# EAGLE schematic Schemat (EAGLE 7.6.0)
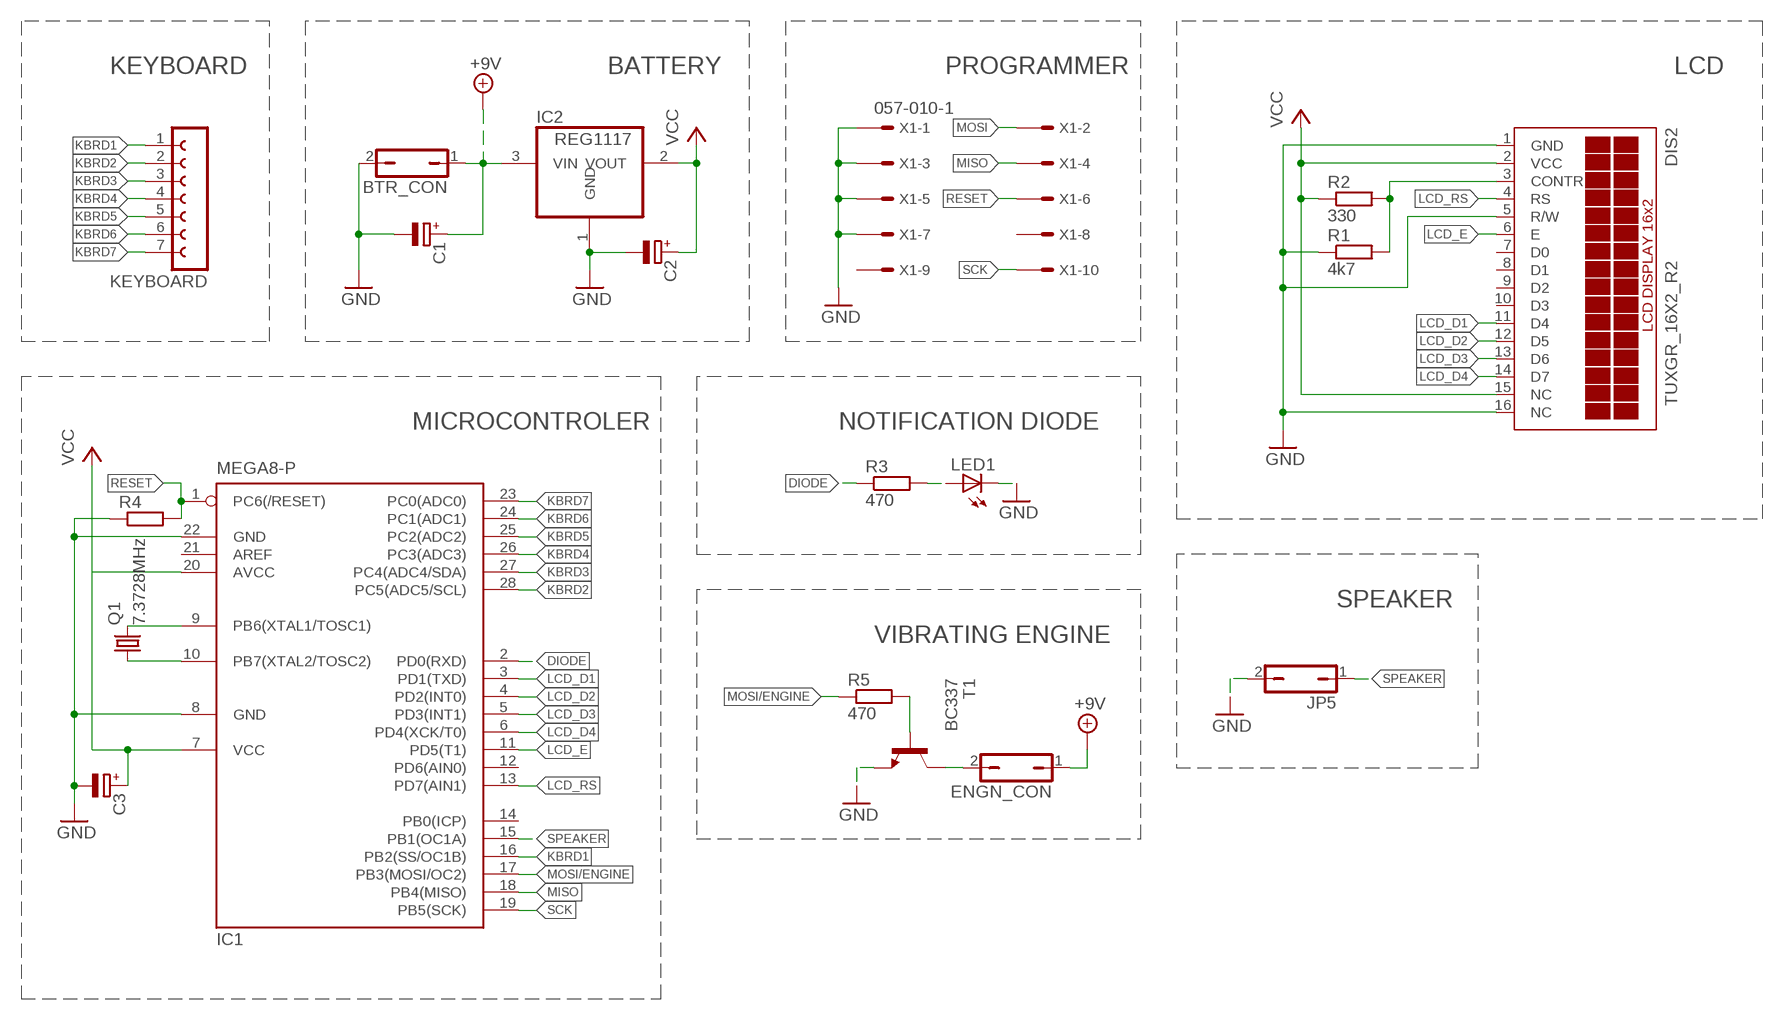
[diagram p0: schematic, sheet 1]

## Parts
BTR_CON  JP1Q  [JP1]
C1  CPOL-EU139CLL-2R  [139CLL-2R]
C2  CPOL-EU139CLL-2R  [139CLL-2R]
C3  CPOL-EU139CLL-2R  [139CLL-2R]
DIS2  TUXGR_16X2_R2  [TUXGR_16X2_R2]
ENGN_CON  JP1Q  [JP1]
IC1  MEGA8-P  [DIL28-3]
IC2  REG1117  [SOT223]
JP5  JP1Q  [JP1]
KEYBOARD  FE07-1  [FE07]
LED1  LED3MM  [LED3MM]
Q1  7.3728MHz  CRYSTALHC49S  [HC49/S]
R1  4k7  R-EU_0207/7  [0207/7]
R2  330  R-EU_0207/7  [0207/7]
R3  470  R-EU_0207/7  [0207/7]
R4  R-EU_0207/7  [0207/7]
R5  470  R-EU_0207/7  [0207/7]
T1  BC337  [TO92]
X1  057-010-1  [057-010-1]

## Nets
+9V: BTR_CON.1 C1.+ ENGN_CON.1 IC2.3(VIN)
DIODE: IC1.2(PD0(RXD)) R3.1
GND: BTR_CON.2 C1.- C2.- C3.- DIS2.1(GND) DIS2.5(R/W) DIS2.16(NC) IC1.8(GND) IC1.22(GND) IC2.1(GND) JP5.2 LED1.K(C) R1.1 R4.1 T1.1(E) X1.1 X1.3 X1.5 X1.7
KBRD1: IC1.16(PB2(SS/OC1B)) KEYBOARD.1
KBRD2: IC1.28(PC5(ADC5/SCL)) KEYBOARD.2
KBRD3: IC1.27(PC4(ADC4/SDA)) KEYBOARD.3
KBRD4: IC1.26(PC3(ADC3)) KEYBOARD.4
KBRD5: IC1.25(PC2(ADC2)) KEYBOARD.5
KBRD6: IC1.24(PC1(ADC1)) KEYBOARD.6
KBRD7: IC1.23(PC0(ADC0)) KEYBOARD.7
LCD_D1: DIS2.11(D4) IC1.3(PD1(TXD))
LCD_D2: DIS2.12(D5) IC1.4(PD2(INT0))
LCD_D3: DIS2.13(D6) IC1.5(PD3(INT1))
LCD_D4: DIS2.14(D7) IC1.6(PD4(XCK/T0))
LCD_E: DIS2.6(E) IC1.11(PD5(T1))
LCD_RS: DIS2.4(RS) IC1.13(PD7(AIN1))
MISO: IC1.18(PB4(MISO)) X1.4
MOSI: X1.2
MOSI/ENGINE: IC1.17(PB3(MOSI/OC2)) R5.1
N$1: IC1.9(PB6(XTAL1/TOSC1)) Q1.2
N$2: IC1.10(PB7(XTAL2/TOSC2)) Q1.1
N$3: DIS2.3(CONTR) R1.2 R2.2
N$4: ENGN_CON.2 T1.3(C)
N$5: LED1.A R3.2
N$6: C3.+ IC1.7(VCC)
N$7: R5.2 T1.2(B)
RESET: IC1.1(PC6(/RESET)) R4.2 X1.6
SCK: IC1.19(PB5(SCK)) X1.10
SPEAKER: IC1.15(PB1(OC1A)) JP5.1
VCC: C2.+ DIS2.2(VCC) DIS2.15(NC) IC1.20(AVCC) IC2.2(VOUT) R2.1
Unconnected: DIS2.7(D0) DIS2.8(D1) DIS2.9(D2) DIS2.10(D3) IC1.12(PD6(AIN0)) IC1.14(PB0(ICP)) IC1.21(AREF) X1.8 X1.9

## Notes on the sheet
- KEYBOARD | BATTERY | PROGRAMMER | LCD
- MICROCONTROLER | NOTIFICATION DIODE
- SPEAKER
- VIBRATING ENGINE

## Library data of the parts
BTR_CON ENGN_CON JP5 = jumper:JP1Q: JUMPER
C1-C3 = rcl:CPOL-EU: POLARIZED CAPACITOR, European symbol
DIS2 = display-lcd:TUXGR_16X2_R2: Tuxgraphics LCD display 16x2 characters reflective, without background light Source: tuxgr_12x2_r2.pdf; OC_FARNELL: unknown; OC_NEWARK: unknown
IC1 = atmel:MEGA8-P: MICROCONTROLLER 8 Kbytes FLASH, 1 kbytes SRAM, 512 bytes EEPROM, USART, 4-channel 10 bit ADC, 2-channel 8 bit ADC Pin compatible with Atmega48, ATMega88, ATMega168 Source: avr.lbr; OC_FARNELL: unknown; OC_NEWARK: unknown
IC2 = burr-brown:REG1117: 800mA and 1A Low Dropout (LDO) Positive Regulator 1.8V, 2.5V, 2.85V, 3.3V, 5V, and Adj; MPN: REG1117; OC_FARNELL: 1097566; OC_NEWARK: 14P6981
KEYBOARD = con-lsta:FE07-1: FEMALE HEADER; OC_FARNELL: unknown; OC_NEWARK: unknown
LED1 = led:LED: LED OSRAM: - CHIPLED LG R971, LG N971, LY N971, LG Q971, LY Q971, LO R971, LY R971 LH N974, LH R974 LS Q976, LO Q976, LY Q976 LO Q996 - Hyper CHIPLED LW Q18S LB Q993, LB Q99A, LB R99A - SideLED LS A670, LO A670, LY A670, LG A670, LP A670 LB A673, LV A673, LT A673, LW A673 LH A674 LY A675 LS A676, LA A676, LO A676, LY A676, LW A676 LS A679, LY A679, LG A679 - Hyper Micro SIDELED® LS Y876, LA Y876, LO Y876, LY Y876 LT Y87S - SmartLED LW L88C, LW L88S LB L89C, LB L89S, LG L890 LS L89K, LO L89K, LY L89K LS L896, LA L896, LO L896, LY L896 - TOPLED LS T670, LO T670, LY T670, LG T670, LP T670 LSG T670, LSP T670, LSY T670, LOP T670, LYG T670 LG T671, LOG T671, LSG T671 LB T673, LV T673, LT T673, LW T673 LH T674 LS T676, LA T676, LO T676, LY T676, LB T676, LH T676, LSB T676, LW T676 LB T67C, LV T67C, LT T67C, LS T67K, LO T67K, LY T67K, LW E67C LS E67B, LA E67B, LO E67B, LY E67B, LB E67C, LV E67C, LT E67C LW T67C LS T679, LY T679, LG T679 LS T770, LO T770, LY T770, LG T770, LP T770 LB T773, LV T773, LT T773, LW T773 LH T774 LS E675, LA E675, LY E675, LS T675 LS T776, LA T776, LO T776, LY T776, LB T776 LHGB T686 LT T68C, LB T68C - Hyper Mini TOPLED® LB M676 - Mini TOPLED Santana® LG M470 LS M47K, LO M47K, LY M47K Source: http://www.osram.convergy.de LUXEON: - LUMILED® LXK2-PW12-R00, LXK2-PW12-S00, LXK2-PW14-U00, LXK2-PW14-V00 LXK2-PM12-R00, LXK2-PM12-S00, LXK2-PM14-U00 LXK2-PE12-Q00, LXK2-PE12-R00, LXK2-PE12-S00, LXK2-PE14-T00, LXK2-PE14-U00 LXK2-PB12-K00, LXK2-PB12-L00, LXK2-PB12-M00, LXK2-PB14-N00, LXK2-PB14-P00, LXK2-PB14-Q00 LXK2-PR12-L00, LXK2-PR12-M00, LXK2-PR14-Q00, LXK2-PR14-R00 LXK2-PD12-Q00, LXK2-PD12-R00, LXK2-PD12-S00 LXK2-PH12-R00, LXK2-PH12-S00 LXK2-PL12-P00, LXK2-PL12-Q00, LXK2-PL12-R00 Source: www.luxeon.com KINGBRIGHT: KA-3528ASYC Source: www.kingbright.com
Q1 = crystal:CRYSTAL: CRYSTAL; OC_FARNELL: 1667008; OC_NEWARK: unknown
R1-R5 = rcl:R-EU_: RESISTOR, European symbol
T1 = transistor:BC337: NPN TRANSISTOR
X1 = con-panduit:057-010-: CONNECTOR 10-pin series 057 contact pc board low profile headers; OC_FARNELL: unknown; OC_NEWARK: unknown